# Altium schematic sheet USBINFRTransiever_Power.SchDoc: Инфракрасный передатчик
size 420 x 297 mm; ApprovedBy: Чукалкин; CheckedBy: Суворов; DrawnBy: Подлесный; DocumentNumber: ФНКЦ.542321.001 Э3; SheetNumber: 1; SheetTotal: 4; DocumentType: Схема электрическая принципиальная; Format: A3; ImagePath: ФНКЦ.542321.001
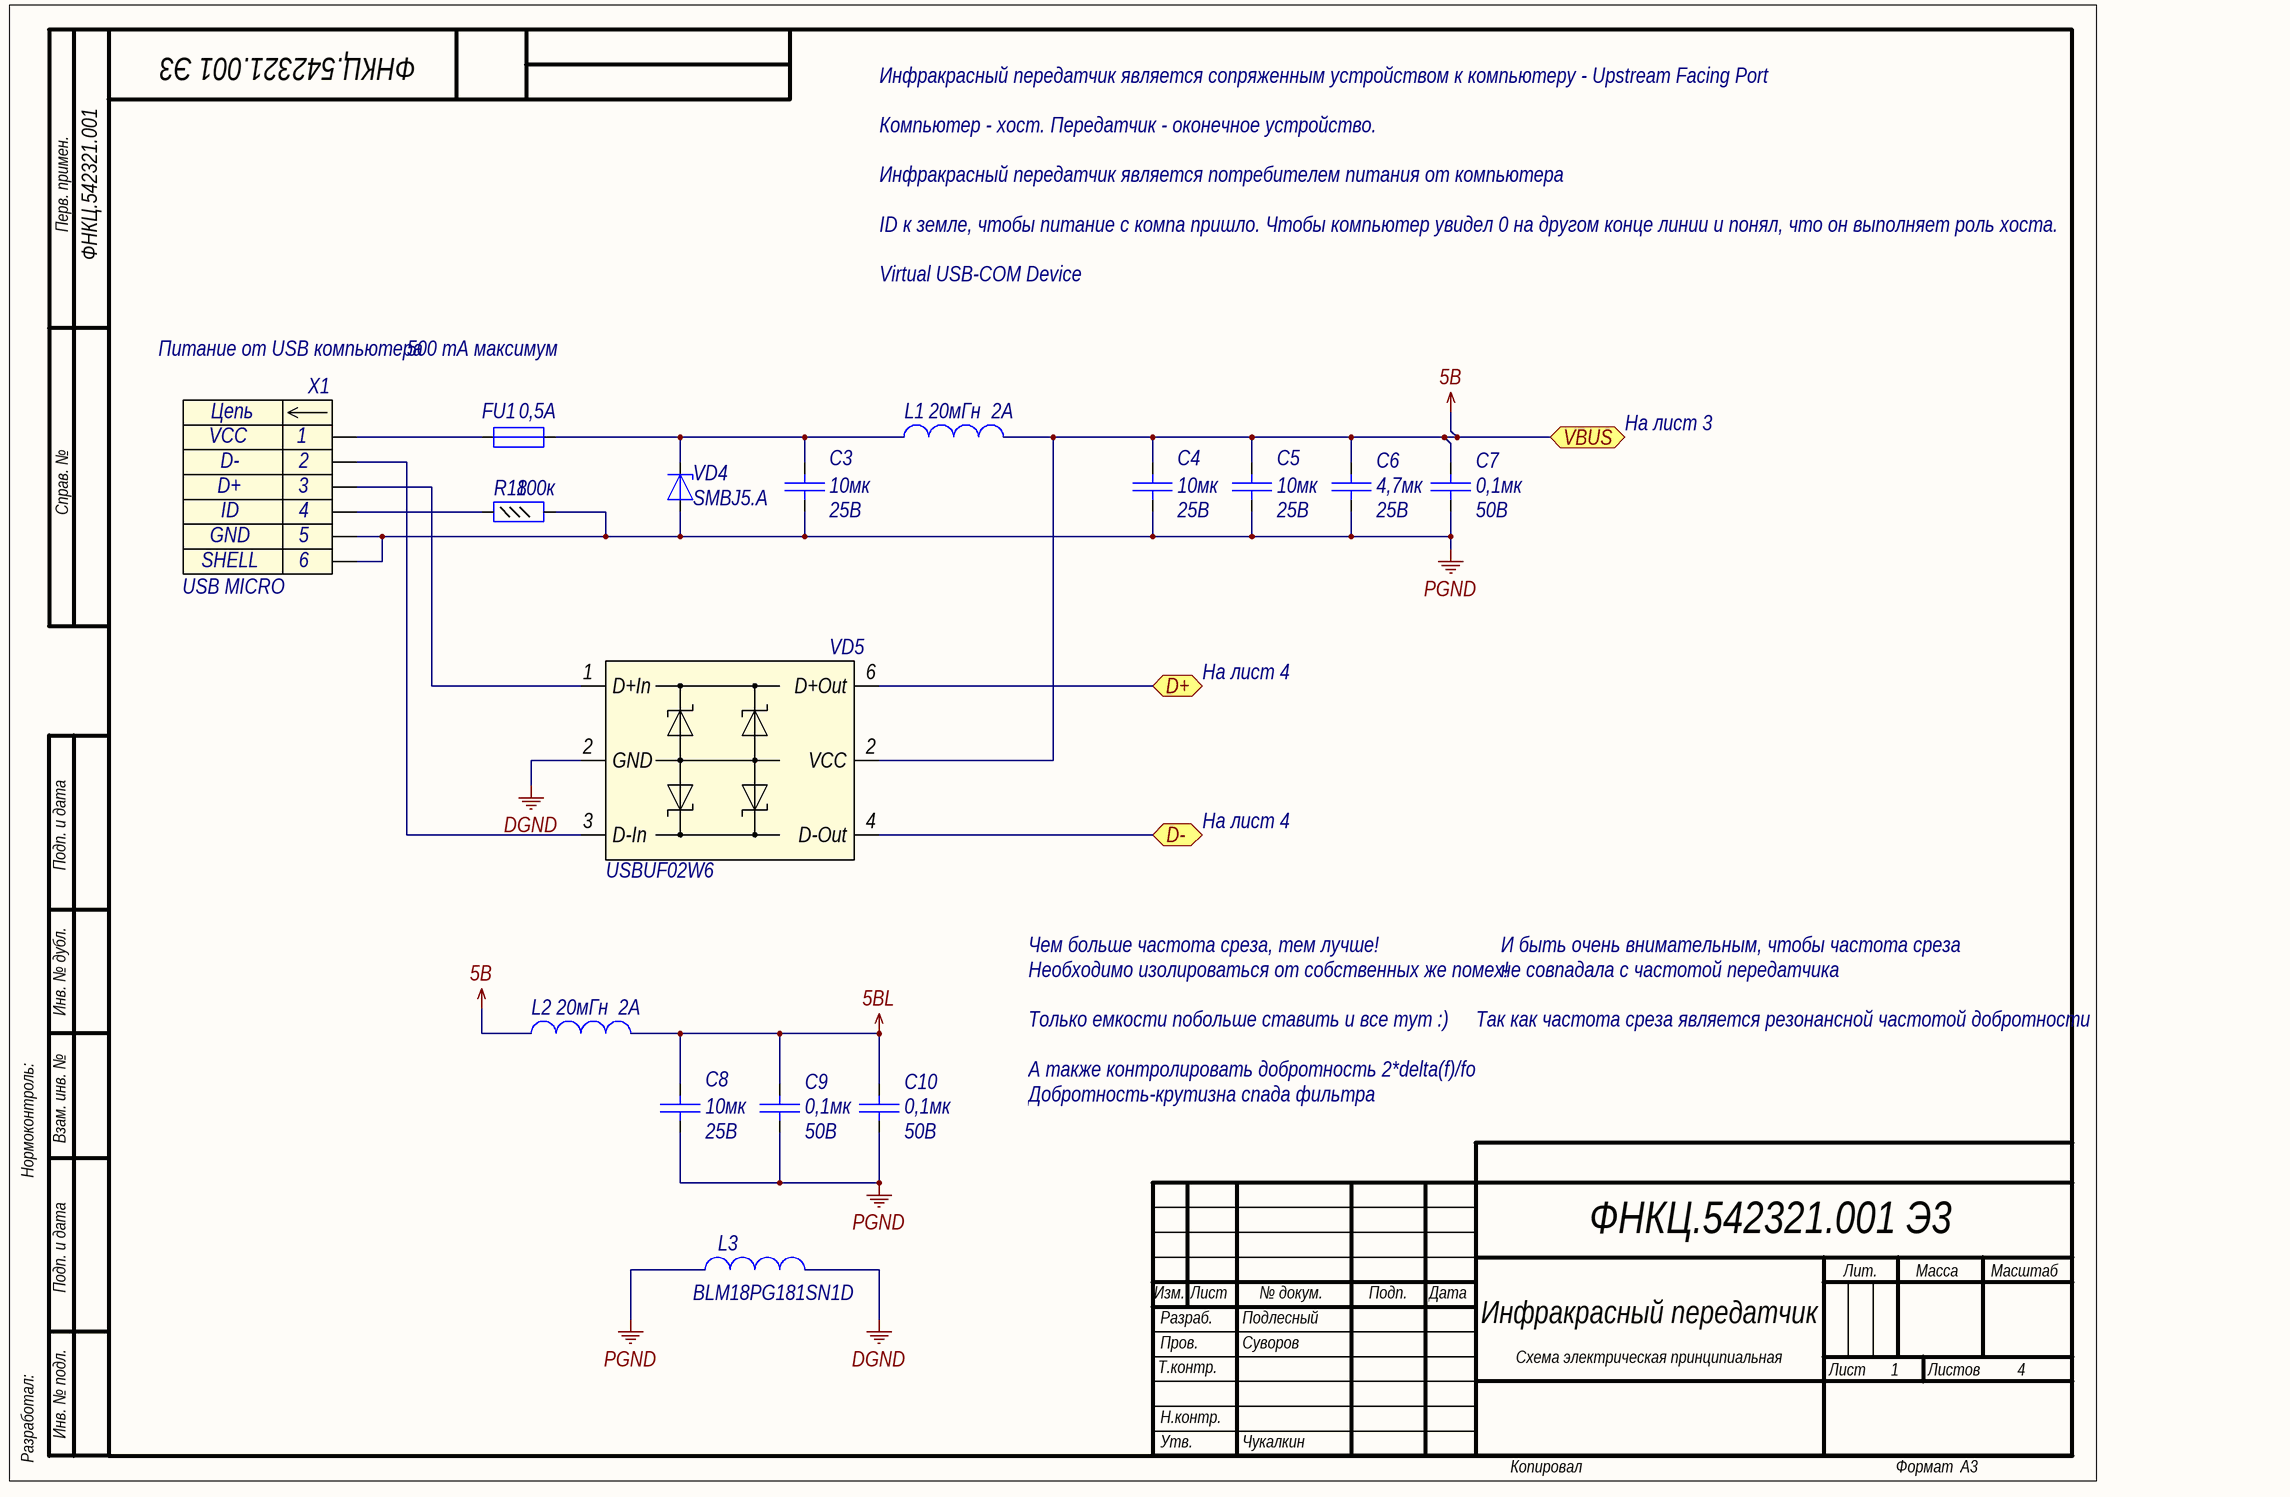
[diagram p0: USBINFRTransiever_Power.SchDoc]

## Parts
C3  value 10мк  Voltage: 25В  [C1206]  (hidden comment: Capacitor)
C4  value 10мк  Voltage: 25В  [C1206]  (hidden comment: Capacitor)
C5  value 10мк  Voltage: 25В  [C1206]  (hidden comment: Capacitor)
C6  value 4,7мк  Voltage: 25B  [C0805]  (hidden comment: Capacitor)
C7  value 0,1мк  Voltage: 50B  [C0805]  (hidden comment: Capacitor)
C8  value 10мк  Voltage: 25В  [C1206]  (hidden comment: Capacitor)
C9  value 0,1мк  Voltage: 50B  [C0805]  (hidden comment: Capacitor)
C10  value 0,1мк  Voltage: 50B  [C0805]  (hidden comment: Capacitor)
FU1  I hold: 0,5A  [FUSE812]  (hidden comment: Fuse)
L1  value 20мГн  Rated Current: 2А  [L0805]  (hidden comment: Inductor)
L2  value 20мГн  Rated Current: 2А  [L0805]  (hidden comment: Inductor)
L3  Part Number: BLM18PG181SN1D  [L0603]  (hidden comment: Inductor)
R18  value 100к  [R0603]  (hidden comment: Resistor_0,062Вт)
VD4  Part Number: SMBJ5.A  [SMB]  (hidden comment: DiodeZener)
VD5  Part Number: USBUF02W6  [SOT323-6L]  (hidden comment: USBUF)
X1  USB MICRO  [USB-B Micro]

## Ports
D+, D-, VBUS

## Nets
5В: C4.2 C5.2 C6.2 C7.2 L1.2 L2.1 VD5.2(VCC) ; port VBUS
5ВL: C8.2 C9.2 C10.2 L2.2
DGND: L3.2 VD5.2(GND)
PGND: C3.1 C4.1 C5.1 C6.1 C7.1 C8.1 C9.1 C10.1 L3.1 R18.2 VD4.2(A) X1.5 X1.6
D+: VD5.6(D+Out) ; port D+
D-: VD5.4(D-Out) ; port D-
NetC3_2: C3.2 FU1.2 L1.1 VD4.1(K)
NetFU1_1: FU1.1 X1.1
NetR18_1: R18.1 X1.4
NetVD5_1: VD5.1(D+In) X1.3
NetVD5_3: VD5.3(D-In) X1.2

## Notes on the sheet
- Инфракрасный передатчик является сопряженным устройством к компьютеру - Upstream Facing Port
- Перв. примен.
- Компьютер - хост. Передатчик - оконечное устройство.
- Инфракрасный передатчик является потребителем питания от компьютера
- ID к земле, чтобы питание с компа пришло. Чтобы компьютер увидел 0 на другом конце линии и понял, что он выполняет роль хоста.
- Virtual USB-COM Device
- Питание от USB компьютера
- 500 mA максимум
- На лист 3
- Справ. №
- На лист 4
- Подп. и дата
- Инв. № дубл.
- Чем больше частота среза, тем лучше!
- Необходимо изолироваться от собственных же помех!
- И быть очень внимательным, чтобы частота среза
- не совпадала с частотой передатчика
- Только емкости побольше ставить и все тут :)
- Так как частота среза является резонансной частотой добротности
- Нормоконтроль:
- Взам. инв. №
- А также контролировать добротность 2*delta(f)/fo
- Добротность-крутизна спада фильтра
- Изм.
- Лист
- № докум.
- Подп.
- Дата
- Лит.
- Масса
- Масштаб
- Т.контр.
- Пров.
- Разраб.
- Листов
- Разработал:
- Инв. № подл.
- Н.контр.
- Утв.
- Копировал
- Формат
- (in symbol connect2) Цепь; SHELL

## Library data of the parts
C3-C5 C8 = cap187: Конденсатор; Part Name: Ceramic; Manufacture: Murata; Part Number: GRM31CR71E106KA12L*; id: cap187; TKE: X7R
C6 = cap154: Конденсатор; Part Name: Ceramic; Manufacture: Murata; Part Number: GRM21BR61E475KA12L; id: cap154; TKE: X5R
C7 C9 C10 = cap142: Конденсатор; Part Name: Ceramic; Manufacture: Murata; Part Number: GRM21BR71H104K**; id: cap142; TKE: X7R
FU1 = fuse8: Предохранитель; Part Name: Resettable Fuses; Manufacture: Bourns; Part Number: MF-MSMF050; id: fuse8; V max: 15B; I max: 100A; I trip: 1A; Resistance: 0,15Ohms
L1 L2 = ind69: EMI Suppression Filter; Part Name: EMI Inductor; Part Number: BLM21PG221SN1D; Manufacture: Murata; id: ind69; Resistance: 0,05Ohm
L3 = ind0: EMI Suppression Filter; Part Name: EMI Suppression Filters; id: ind0; Rated Current: 1,5A; Resistance: 0,09Ohm
R18 = res507: Резистор; Manufacture: Yageo; Part Number: RC0603FR-07100KL; id: res507; Accuracy: 1%; Part Name: Resistor; Power: 0,062Вт
VD4 = SMBJ5.A: Cтабилитрон (лавинный выпрямительный диод) односторонний; Part Name: TVS diode Unidirectional; Manufacture: ST Microelectronics; id: tvs68; Leakage Current: 20uA; Stand-off Voltage: 5B; Breakdown Voltage: 6,74B; Clamping voltage: 9,2B; Dynamic resistance: 0,031Ohm; Peak Pulse Power: 600W; Number of diodes: 1
VD5 = diode23: EMEMI filter and line termination for USB upstream ports; Part Name: EMI filter for USB upstream ports; Manufacture: ST Microelectronics; Capacitance: 47pF; Number of Channels: 2; id: diode23
X1 = connect2: Part Name: Micro USB 5S-B; Part Number: KLS1-233-0-0-1-T; Contact_1: VCC; Contact_2: D-; Contact_3: D+; Contact_4: ID; Contact_5: GND; Contact_6: Shell; id: connect2